# Altium schematic sheet Controller Board.SchDoc: Nixie Clock Controller
size A4; DrawnBy: Thorben Zethoff; Revision: 1.0
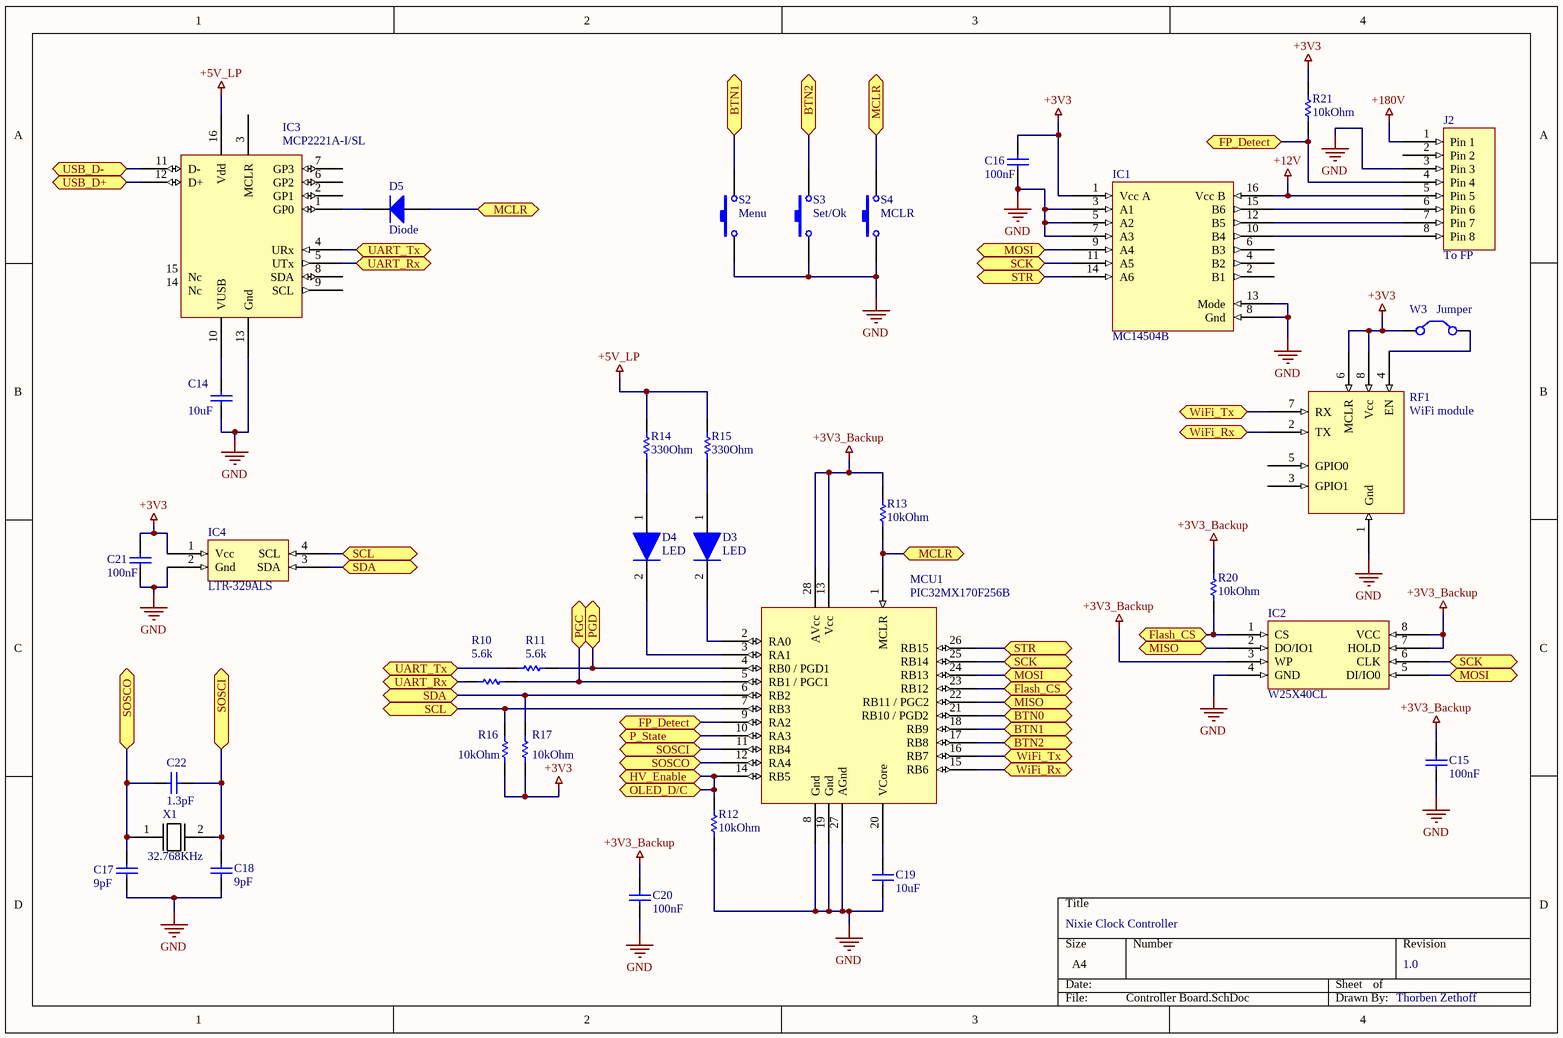
[diagram p0: Controller Board.SchDoc]

## Parts
C14  10uF  [0603]
C15  100nF  [0603]
C16  100nF  [0603]
C17  9pF  [0603]
C18  9pF  [0603]
C19  10uF  [0603]
C20  100nF  [0603]
C21  100nF  [0603]
C22  1.3pF  [0603]
D3  LED  [0603]
D4  LED  [0603]
D5  Diode  [SOD523]
IC1  MC14504B  [TSSOP16]
IC2  W25X40CL  [SOIC8]
IC3  MCP2221A-I/SL  [QFN16 4x4]
IC4  ‎LTR-329ALS  [4DFN]
J2  To FP  [Molex 0528080871]
MCU1  PIC32MX170F256B  [TSSOP28_Wide]
R10  5.6k  [0805]
R11  5.6k  [0805]
R12  10kOhm  [0603]
R13  10kOhm  [0603]
R14  330Ohm  [0603]
R15  330Ohm  [0603]
R16  10kOhm  [0603]
R17  10kOhm  [0603]
R20  10kOhm  [0603]
R21  10kOhm  [0603]
RF1  WiFi module  [EPS8266 Module]
S2  Menu  [EVQP7XXX]
S3  Set/Ok  [EVQP7XXX]
S4  MCLR  [EVQP7XXX]
W3  Jumper  [Solder Jumper]
X1  32.768KHz  [2-SMD, Quartz]

## Ports
BTN0 (bidir), BTN1 (bidir), BTN2 (bidir), Flash_CS (bidir), FP_Detect (bidir), HV_Enable (bidir), MCLR (bidir), MISO (bidir), MOSI (bidir), OLED_D/C (bidir), P_State (bidir), PGC (bidir), PGD (bidir), SCK (bidir), SCL (bidir), SDA (bidir), SOSCI (bidir), SOSCO (bidir), STR (bidir), UART_Rx (bidir), UART_Tx (bidir), USB_D+ (bidir), USB_D- (bidir), WiFi_Rx (bidir), WiFi_Tx (bidir)

## Nets
+3V3: C16.1 C21.1 IC1.1(Vcc_A) IC4.1(Vcc) R16.1 R17.1 R21.2 RF1.6(MCLR) RF1.8(Vcc) W3.1(C1)
+3V3_Backup: C15.1 C20.1 IC2.3(WP) IC2.7(HOLD) IC2.8(VCC) MCU1.13(Vcc) MCU1.28(AVcc) R13.2 R20.2
+5V_LP: IC3.16(Vdd) R14.2 R15.1
+12V: IC1.16(Vcc_B) J2.5(Pin_5)
+180V: J2.1(Pin_1)
GND: C14.2 C15.2 C16.2 C17.2 C18.2 C19.2 C20.2 C21.2 IC1.3(A1) IC1.5(A2) IC1.7(A3) IC1.8(Gnd) IC1.13(Mode) IC2.4(GND) IC3.13(Gnd) IC4.2(Gnd) J2.3(Pin_3) MCU1.8(Gnd) MCU1.19(Gnd) MCU1.27(AGnd) R12.1 RF1.1(Gnd) S2.1 S3.1 S4.1
BTN0: MCU1.21(RB10_/_PGD2) ; port BTN0
BTN1: MCU1.18(RB9) S2.2 ; port BTN1
BTN2: MCU1.17(RB8) S3.2 ; port BTN2
Flash_CS: IC2.1(CS) MCU1.23(RB12) R20.1 ; port Flash_CS
FP_Detect: J2.4(Pin_4) MCU1.9(RA2) R21.1 ; port FP_Detect
HV_Enable: MCU1.14(RB5) R12.2 ; port HV_Enable, port OLED_D/C
MCLR: D5.1(A) MCU1.1(MCLR) R13.1 S4.2 ; port MCLR
MISO: IC2.2(DO/IO1) MCU1.22(RB11_/_PGC2) ; port MISO
MOSI: IC1.9(A4) IC2.5(DI/IO0) MCU1.24(RB13) ; port MOSI
P_State: MCU1.10(RA3) ; port P_State
PGC: MCU1.5(RB1_/_PGC1) R10.2 ; port PGC
PGD: MCU1.4(RB0_/_PGD1) R11.1 ; port PGD
SCK: IC1.11(A5) IC2.6(CLK) MCU1.25(RB14) ; port SCK
SCL: IC4.4(SCL) MCU1.7(RB3) R16.2 ; port SCL
SDA: IC4.3(SDA) MCU1.6(RB2) R17.2 ; port SDA
SOSCI: C18.1 C22.2 MCU1.11(RB4) X1.2 ; port SOSCI
SOSCO: C17.1 C22.1 MCU1.12(RA4) X1.1 ; port SOSCO
STR: IC1.14(A6) MCU1.26(RB15) ; port STR
UART_Rx: IC3.5(UTx) R10.1 ; port UART_Rx
UART_Tx: IC3.4(URx) R11.2 ; port UART_Tx
USB_D+: IC3.12(D+) ; port USB_D+
USB_D-: IC3.11(D-) ; port USB_D-
WiFi_Rx: MCU1.15(RB6) RF1.2(TX) ; port WiFi_Rx
WiFi_Tx: MCU1.16(RB7) RF1.7(RX) ; port WiFi_Tx
NetC14_1: C14.1 IC3.10(VUSB)
NetC19_1: C19.1 MCU1.20(VCore)
NetD3_1: D3.1 R15.2
NetD3_2: D3.2 MCU1.2(RA0)
NetD4_1: D4.1 R14.1
NetD4_2: D4.2 MCU1.3(RA1)
NetD5_2: D5.2(K) IC3.1(GP0)
NetIC1_10: IC1.10(B4) J2.8(Pin_8)
NetIC1_12: IC1.12(B5) J2.7(Pin_7)
NetIC1_15: IC1.15(B6) J2.6(Pin_6)
NetRF1_4: RF1.4(EN) W3.2(C2)

Not connected (* = marked no-connect by the designer): IC1 2(B1) 4(B2) 6(B3); IC3 2(GP1) 3(MCLR) 6(GP2) 7(GP3) 8(SDA) 9(SCL) 14(Nc) 15(Nc); J2 2(Pin_2); RF1 3(GPIO1) 5(GPIO0)

## Library data of the parts
C14-C22 = Cap: Capacitor; Published: 8-Jun-2000; LatestRevisionDate: 17-Jul-2002; LatestRevisionNote: Re-released for DXP Platform.; PackageReference: RAD-0.3; Publisher: Altium Limited; PackageDescription: Radial Cap, Thru-Hole; 2 Leads; 0.3 in Pin Spacing
D5 = Diode: Default Diode; pin to pad: 1>2 2>1; Published: 8-Jun-2000; LatestRevisionDate: 17-Jul-2002; LatestRevisionNote: Re-released for DXP Platform.; PackageVersion: Sep-1996; PackageReference: SMC; Publisher: Altium Limited; PackageDescription: DO-214-AB/SMC; 2 C-Bend Leads; Body 7.9 x 5.9 mm, inc. leads (LxW); Code_JEDEC: DO-214-AB
IC1 = MC14504B: 6ch Level shifter
IC3 = MCP2221A-I/SL: USB to Uart/I2C Converter
IC4 = ‎LTR-329ALS: Ambient light sensor with ADC
J2 = Molex 0528080871: 8 Pin FFC SMD staight
MCU1 = PIC32MX1xxFxxxB
R10 R11 = Res1: Published: 8-Jun-2000; LatestRevisionDate: 17-Jul-2002; LatestRevisionNote: Re-released for DXP Platform.; PackageReference: AXIAL-0.3; Publisher: Altium Limited; PackageDescription: Axial Device, Thru-Hole; 2 Leads; 0.3 in Pin Spacing
R12-R17 R20 R21 = Res1: Resistor; Published: 8-Jun-2000; LatestRevisionDate: 17-Jul-2002; LatestRevisionNote: Re-released for DXP Platform.; PackageReference: AXIAL-0.3; Publisher: Altium Limited; PackageDescription: Axial Device, Thru-Hole; 2 Leads; 0.3 in Pin Spacing
RF1 = ESP8266
S2 S3 = SW-PB: Switch; Published: 24-Mar-1999; LatestRevisionDate: 17-Jul-2002; LatestRevisionNote: Re-released for DXP Platform.; PackageReference: SPST-2; Publisher: Altium Limited; PackageDescription: Switch; 2 Leads
S4 = SW-PB: Published: 24-Mar-1999; LatestRevisionDate: 17-Jul-2002; LatestRevisionNote: Re-released for DXP Platform.; PackageReference: SPST-2; Publisher: Altium Limited; PackageDescription: Switch; 2 Leads
W3 = Jumper: I2C Passthrough; Published: 24-Mar-1999; LatestRevisionDate: 17-Jul-2002; LatestRevisionNote: Re-released for DXP Platform.; PackageReference: RAD-0.2; Publisher: Altium Limited; PackageDescription: Radial Cap, Thru-Hole; 2 Leads; 0.2 in Pin Spacing
X1 = Tuning fork crystal
IC2 = W25X40CL: ComponentLink1Description: Datasheet; ComponentLink1URL: https://www.winbond.com/resource-files/w25x40cl_f%2020140325.pdf